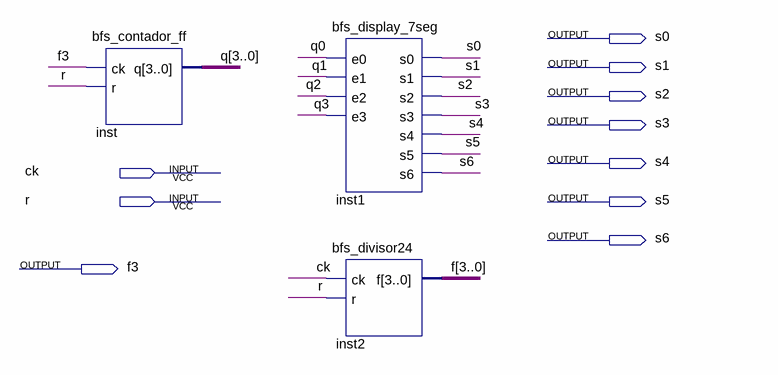
[diagram p0: schematic sheet]
// Quartus schematic bfs_contador_sincrono.bdf as structural Verilog: 3 symbols, 10 pins
module bfs_contador_sincrono (
  input  ck,
  input  r,
  output s0,
  output s1,
  output s2,
  output s3,
  output s4,
  output s5,
  output s6,
  output f3
);

  wire [2:0] f;
  wire [3:0] q;

  bfs_contador_ff inst (.ck(f3), .r(r), .q(q));
  bfs_display_7seg inst1 (
    .e0(q[0]), .e1(q[1]), .e2(q[2]), .e3(q[3]), .s0(s0), .s1(s1), .s2(s2), .s3(s3), .s4(s4), .s5(s5), .s6(s6));
  bfs_divisor24 inst2 (.ck(ck), .r(r), .f({f3, f}));
endmodule
